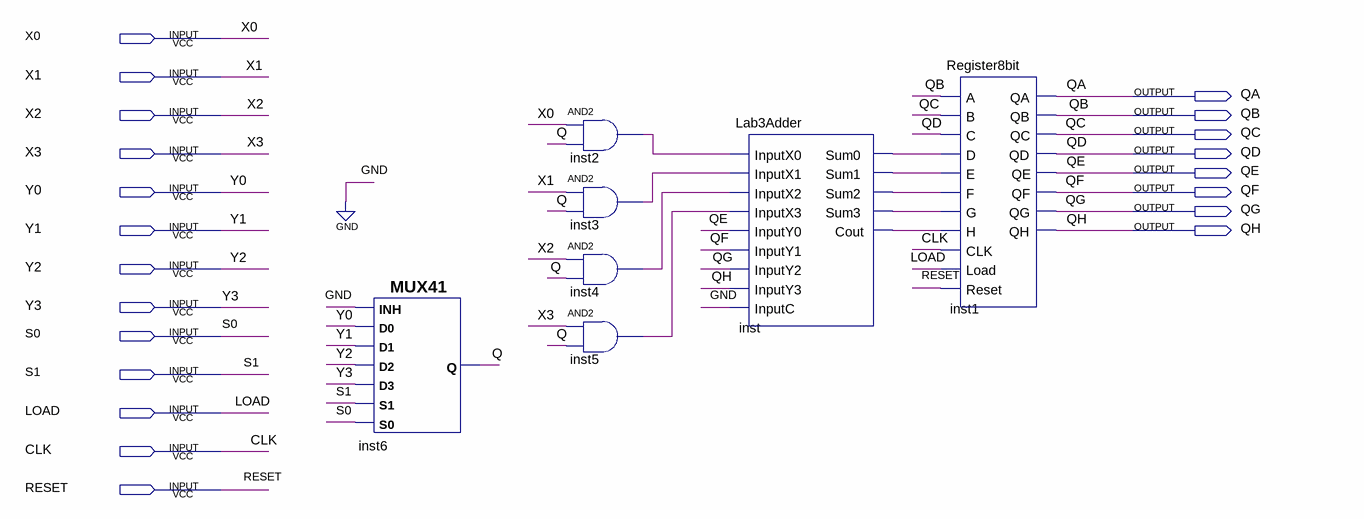
[diagram p0: schematic sheet]
// Quartus schematic Bit4Multiplier.bdf as structural Verilog: 7 symbols, 21 pins
module Bit4Multiplier (
  input  X0,
  input  X1,
  input  X2,
  input  X3,
  input  Y0,
  input  Y1,
  input  Y2,
  input  Y3,
  input  S0,
  input  S1,
  input  LOAD,
  input  CLK,
  input  RESET,
  output QA,
  output QB,
  output QC,
  output QD,
  output QE,
  output QF,
  output QG,
  output QH
);

  wire inst2_out, inst3_out, inst4_out, inst5_out, inst_cout, inst_sum0, inst_sum1, inst_sum2, inst_sum3, Q;

  MUX41 inst6 (.S0(S0), .D2(Y2), .S1(S1), .D3(Y3), .D0(Y0), .INH(1'b0), .D1(Y1), .Q(Q));
  and inst2 (inst2_out, X0, Q);
  and inst3 (inst3_out, X1, Q);
  and inst4 (inst4_out, X2, Q);
  and inst5 (inst5_out, X3, Q);
  Lab3Adder inst (
    .InputX0(inst2_out), .InputX1(inst3_out), .InputX2(inst4_out), .InputX3(inst5_out), .InputY0(QE),
    .InputY1(QF), .InputY2(QG), .InputY3(QH), .InputC(1'b0), .Sum0(inst_sum0), .Sum1(inst_sum1),
    .Sum2(inst_sum2), .Sum3(inst_sum3), .Cout(inst_cout));
  Register8bit inst1 (
    .A(QB), .B(QC), .C(QD), .D(inst_sum0), .E(inst_sum1), .F(inst_sum2), .G(inst_sum3), .H(inst_cout),
    .CLK(CLK), .Load(LOAD), .Reset(RESET), .QA(QA), .QB(QB), .QC(QC), .QD(QD), .QE(QE), .QF(QF), .QG(QG),
    .QH(QH));
endmodule
